# Altium schematic sheet CTL_RELAY_SHEET1_CCU_HAS.SchDoc: CCU - HVAC Relays
size B; DrawnBy: M. Seago; Organization: Gravitas; Address1: Sponsored By:; Address2: Alan Morgan; Address3: Technical Advisor:; Address4: Dr. Joseph Morgan; Revision: 1A; SheetNumber: 7; SheetTotal: 9
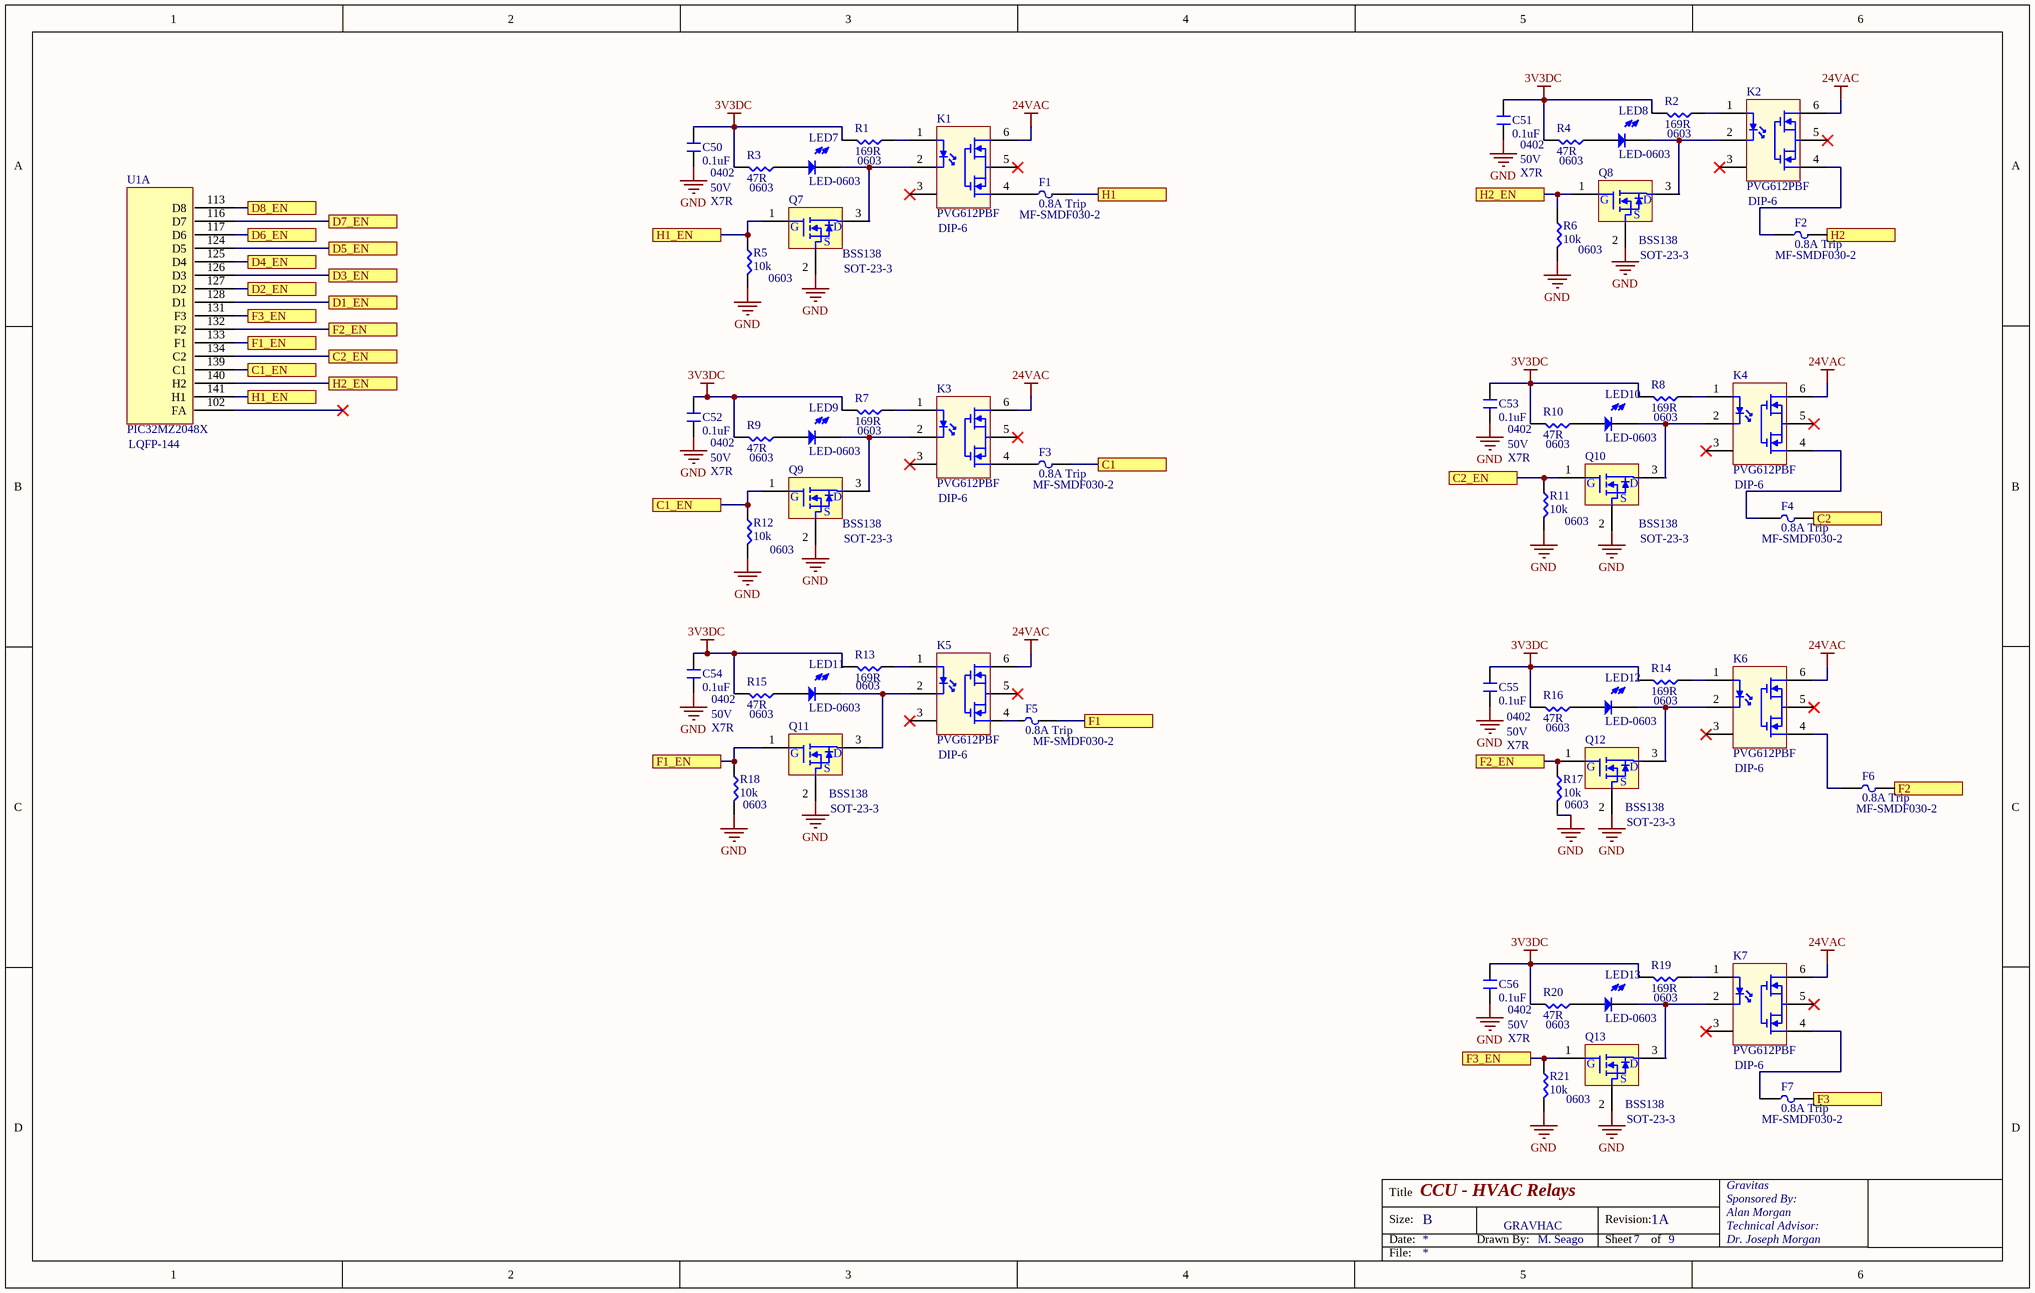
[diagram p0: CTL_RELAY_SHEET1_CCU_HAS.SchDoc]

## Parts
C50  0.1uF  [NonPolar-0402]
C51  0.1uF  [NonPolar-0402]
C52  0.1uF  [NonPolar-0402]
C53  0.1uF  [NonPolar-0402]
C54  0.1uF  [NonPolar-0402]
C55  0.1uF  [NonPolar-0402]
C56  0.1uF  [NonPolar-0402]
F1  0.8A Trip  [Fuse-MF-SMDF030-2]
F2  0.8A Trip  [Fuse-MF-SMDF030-2]
F3  0.8A Trip  [Fuse-MF-SMDF030-2]
F4  0.8A Trip  [Fuse-MF-SMDF030-2]
F5  0.8A Trip  [Fuse-MF-SMDF030-2]
F6  0.8A Trip  [Fuse-MF-SMDF030-2]
F7  0.8A Trip  [Fuse-MF-SMDF030-2]
K1  PVG612PBF  [PVG612PBF]
K2  PVG612PBF  [PVG612PBF]
K3  PVG612PBF  [PVG612PBF]
K4  PVG612PBF  [PVG612PBF]
K5  PVG612PBF  [PVG612PBF]
K6  PVG612PBF  [PVG612PBF]
K7  PVG612PBF  [PVG612PBF]
LED7  LED-0603  [LED-0603]
LED8  LED-0603  [LED-0603]
LED9  LED-0603  [LED-0603]
LED10  LED-0603  [LED-0603]
LED11  LED-0603  [LED-0603]
LED12  LED-0603  [LED-0603]
LED13  LED-0603  [LED-0603]
Q7  BSS138  [BSS138-SOT23]
Q8  BSS138  [BSS138-SOT23]
Q9  BSS138  [BSS138-SOT23]
Q10  BSS138  [BSS138-SOT23]
Q11  BSS138  [BSS138-SOT23]
Q12  BSS138  [BSS138-SOT23]
Q13  BSS138  [BSS138-SOT23]
R1  169R  [NonPolar-0603]
R2  169R  [NonPolar-0603]
R3  47R  [NonPolar-0603]
R4  47R  [NonPolar-0603]
R5  10k  [NonPolar-0603]
R6  10k  [NonPolar-0603]
R7  169R  [NonPolar-0603]
R8  169R  [NonPolar-0603]
R9  47R  [NonPolar-0603]
R10  47R  [NonPolar-0603]
R11  10k  [NonPolar-0603]
R12  10k  [NonPolar-0603]
R13  169R  [NonPolar-0603]
R14  169R  [NonPolar-0603]
R15  47R  [NonPolar-0603]
R16  47R  [NonPolar-0603]
R17  10k  [NonPolar-0603]
R18  10k  [NonPolar-0603]
R19  169R  [NonPolar-0603]
R20  47R  [NonPolar-0603]
R21  10k  [NonPolar-0603]
U1  PIC32MZ2048X  [BIG_PIC32MZ]  (part A of 7)

## Ports
C1, C1_EN, C2, C2_EN, D1_EN, D2_EN, D3_EN, D4_EN, D5_EN, D6_EN, D7_EN, D8_EN, F1, F1_EN, F2, F2_EN, F3, F3_EN, H1, H1_EN, H2, H2_EN

## Nets
3V3DC: C50.2 C51.2 C52.2 C53.2 C54.2 C55.2 C56.2 R1.1 R2.1 R3.1 R4.1 R7.1 R8.1 R9.1 R10.1 R13.1 R14.1 R15.1 R16.1 R19.1 R20.1
24VAC: K1.6 K2.6 K3.6 K4.6 K5.6 K6.6 K7.6
GND: C50.1 C51.1 C52.1 C53.1 C54.1 C55.1 C56.1 Q7.2(S) Q8.2(S) Q9.2(S) Q10.2(S) Q11.2(S) Q12.2(S) Q13.2(S) R5.1 R6.1 R11.1 R12.1 R17.1 R18.1 R21.1
C1: F3.2 ; port C1
C1_EN: Q9.1(G) R12.2 U1.139(C1) ; port C1_EN
C2: F4.2 ; port C2
C2_EN: Q10.1(G) R11.2 U1.134(C2) ; port C2_EN
D1_EN: U1.128(D1) ; port D1_EN
D2_EN: U1.127(D2) ; port D2_EN
D3_EN: U1.126(D3) ; port D3_EN
D4_EN: U1.125(D4) ; port D4_EN
D5_EN: U1.124(D5) ; port D5_EN
D6_EN: U1.117(D6) ; port D6_EN
D7_EN: U1.116(D7) ; port D7_EN
D8_EN: U1.113(D8) ; port D8_EN
F1: F5.2 ; port F1
F1_EN: Q11.1(G) R18.2 U1.133(F1) ; port F1_EN
F2: F6.2 ; port F2
F2_EN: Q12.1(G) R17.2 U1.132(F2) ; port F2_EN
F3: F7.2 ; port F3
F3_EN: Q13.1(G) R21.2 U1.131(F3) ; port F3_EN
H1: F1.2 ; port H1
H1_EN: Q7.1(G) R5.2 U1.141(H1) ; port H1_EN
H2: F2.2 ; port H2
H2_EN: Q8.1(G) R6.2 U1.140(H2) ; port H2_EN
NetF1_1: F1.1 K1.4
NetF2_1: F2.1 K2.4
NetF3_1: F3.1 K3.4
NetF4_1: F4.1 K4.4
NetF5_1: F5.1 K5.4
NetF6_1: F6.1 K6.4
NetF7_1: F7.1 K7.4
NetK1_1: K1.1 R1.2
NetK1_2: K1.2 LED7.2 Q7.3(D)
NetK2_1: K2.1 R2.2
NetK2_2: K2.2 LED8.2 Q8.3(D)
NetK3_1: K3.1 R7.2
NetK3_2: K3.2 LED9.2 Q9.3(D)
NetK4_1: K4.1 R8.2
NetK4_2: K4.2 LED10.2 Q10.3(D)
NetK5_1: K5.1 R13.2
NetK5_2: K5.2 LED11.2 Q11.3(D)
NetK6_1: K6.1 R14.2
NetK6_2: K6.2 LED12.2 Q12.3(D)
NetK7_1: K7.1 R19.2
NetK7_2: K7.2 LED13.2 Q13.3(D)
NetLED7_1: LED7.1 R3.2
NetLED8_1: LED8.1 R4.2
NetLED9_1: LED9.1 R9.2
NetLED10_1: LED10.1 R10.2
NetLED11_1: LED11.1 R15.2
NetLED12_1: LED12.1 R16.2
NetLED13_1: LED13.1 R20.2

Not connected (* = marked no-connect by the designer): K1 3(18)* 5(14)*; K2 3(18)* 5(14)*; K3 3(18)* 5(14)*; K4 3(18)* 5(14)*; K5 3(18)* 5(14)*; K6 3(18)* 5(14)*; K7 3(18)* 5(14)*; U1 102(FA)*

## Notes on the sheet
- (near R1) 0603
- 0402
- 50V
- (near R4) 0603
- (near R2) 0603
- X7R
- (near R3) 0603
- (near K1) DIP-6
- (near F1) MF-SMDF030-2
- DIP-6
- 0603
- (near Q7) SOT-23-3
- (near Q8) SOT-23-3
- (near F2) MF-SMDF030-2
- (near R7) 0603
- (near R10) 0402
- (near R8) 0603
- (near U1) LQFP-144
- (near R9) 0603
- (near K3) DIP-6
- (near F3) MF-SMDF030-2
- (near R10) 0603
- (near Q9) SOT-23-3
- (near Q10) SOT-23-3
- (near F4) MF-SMDF030-2
- (near R15) 0402
- (near R13) 0603
- (near R14) 0603
- (near R15) 0603
- (near K5) DIP-6
- (near F5) MF-SMDF030-2
- (near R16) 0402
- (near R16) 0603
- (near K6) DIP-6
- (near R18) 0603
- (near Q11) SOT-23-3
- (near Q12) SOT-23-3
- (near F6) MF-SMDF030-2
- (near R20) 0402
- (near R20) 0603
- (near R19) 0603
- (near Q13) 0603
- (near Q13) SOT-23-3
- (near F7) MF-SMDF030-2
- GRAVHAC
- Title
- Size:
- Date:
- B
- Drawn By:
- Revision:
- Sheet
- of
- File:

## Library data of the parts
C50-C56 = Cap - 0402
F1-F7 = Fuse-MF-SMDF030-2
K1-K7 = PVG612PBF: PhotoVoltaic Relay
R1-R21 = Res - 0603